# Altium schematic sheet STM32L4.SchDoc
size A4
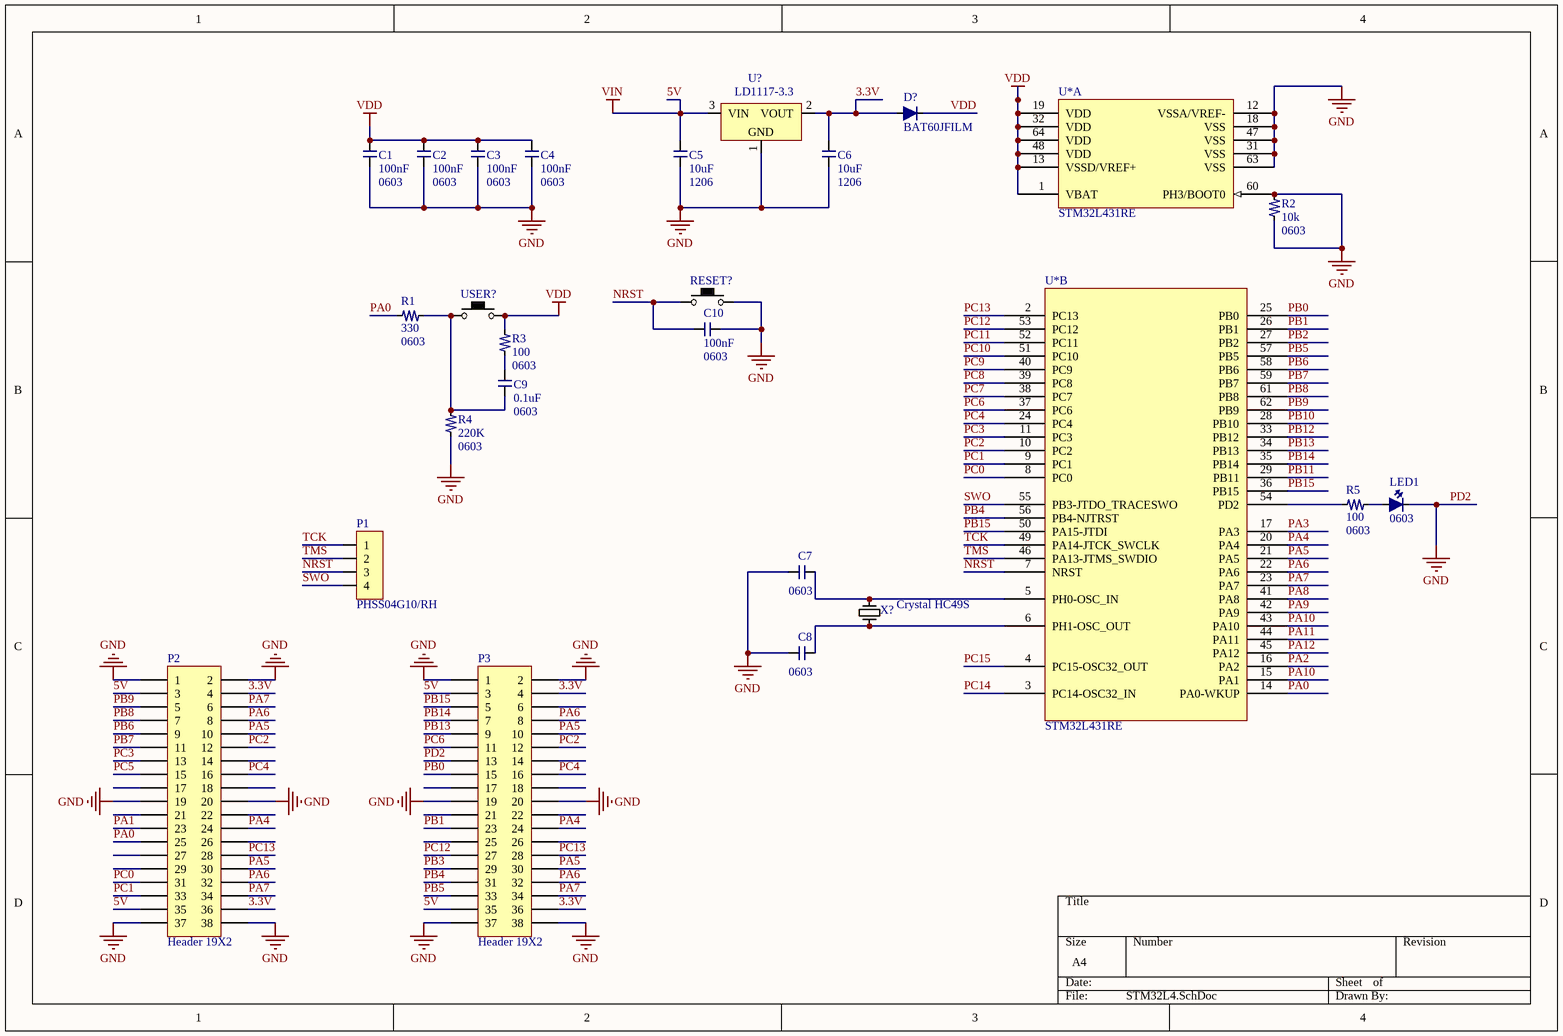
[diagram p0: STM32L4.SchDoc]

## Parts
C1  100nF  [Chip 0603C]
C2  100nF  [Chip 0603C]
C3  100nF  [Chip 0603C]
C4  100nF  [Chip 0603C]
C5  10uF  [Chip 1206C]
C6  10uF  [Chip 1206C]
C7  C HighQ  [Chip 0603C]  (value not drawn)
C8  C HighQ  [Chip 0603C]  (value not drawn)
C9  0.1uF  [Chip 0603C]
C10  100nF  [Chip 0603C]
D?  BAT60JFILM  [SOD323]
LED1  LED  [CHIP LED 0603]  (value not drawn)
P1  PHSS04G10/RH  [PHSS04G10/RH]
P2  Header 19X2  [HDR2X19]
P3  Header 19X2  [HDR2X19]
R1  330  [Chip 0603R]
R2  10k  [Chip 0603R]
R3  100  [Chip 0603R]
R4  220K  [Chip 0603R]
R5  100  [Chip 0603R]
RESET?  Tact Switches  [TC-0102-Series]  (value not drawn)
U*  STM32L431RE  [STM32L431RE-FP]  (parts A,B of 2)
U?  LD1117-3.3  [SOT-223]
USER?  Tact Switches  [TC-0102-Series]  (value not drawn)
X?  Crystal HC49S  [HC-49S]

## Nets
5V: C5.2 P2.3 P2.35 P3.3 P3.35 U?.3(VIN)  [also labelled VIN]
PD2: C1.1 C2.1 C3.1 C4.1 C5.1 C6.1 C7.1 C8.1 C10.2 LED1.2 P2.1 P2.2 P2.19 P2.20 P2.37 P2.38 P3.1 P3.2 P3.13 P3.19 P3.20 P3.37 P3.38 R2.1 R2.2 R4.2 RESET?.2 U*.12(VSSA/VREF-) U*.18(VSS) U*.31(VSS) U*.47(VSS) U*.60(PH3/BOOT0) U*.63(VSS) U?.1(GND)  [also labelled GND]
VDD: C1.2 C2.2 C3.2 C4.2 D?.2 R3.2 U*.1(VBAT) U*.13(VSSD/VREF+) U*.19(VDD) U*.32(VDD) U*.48(VDD) U*.64(VDD) USER?.2
3.3V: C6.2 D?.1 P2.4 P2.36 P3.4 P3.36 U?.2(VOUT)
NRST: C10.1 P1.3 RESET?.1 U*.7(NRST)
PA0: P2.25 R1.2 U*.14(PA0-WKUP)
PA1: P2.23
PA2: U*.16(PA2)
PA3: U*.17(PA3)
PA4: P2.24 P3.24 U*.20(PA4)
PA5: P2.10 P2.30 P3.10 P3.30 U*.21(PA5)
PA6: P2.8 P2.32 P3.8 P3.32 U*.22(PA6)
PA7: P2.6 P2.34 P3.34 U*.23(PA7)
PA8: U*.41(PA8)
PA9: U*.42(PA9)
PA10: U*.15(PA1) U*.43(PA10)
PA11: U*.44(PA11)
PA12: U*.45(PA12)
PB0: P3.15 U*.25(PB0)
PB1: P3.23 U*.26(PB1)
PB2: U*.27(PB2)
PB3: P3.29
PB4: P3.31 U*.56(PB4-NJTRST)
PB5: P3.33 U*.57(PB5)
PB6: P2.9 U*.58(PB6)
PB7: P2.11 U*.59(PB7)
PB8: P2.7 U*.61(PB8)
PB9: P2.5 U*.62(PB9)
PB10: U*.28(PB10)
PB11: U*.29(PB11)
PB12: U*.33(PB12)
PB13: P3.9 U*.34(PB13)
PB14: P3.7 U*.35(PB14)
PB15: P3.5 U*.36(PB15) U*.50(PA15-JTDI)
PC0: P2.31 U*.8(PC0)
PC1: P2.33 U*.9(PC1)
PC2: P2.12 P3.12 U*.10(PC2)
PC3: P2.13 U*.11(PC3)
PC4: P2.16 P3.16 U*.24(PC4)
PC5: P2.15
PC6: P3.11 U*.37(PC6)
PC7: U*.38(PC7)
PC8: U*.39(PC8)
PC9: U*.40(PC9)
PC10: U*.51(PC10)
PC11: U*.52(PC11)
PC12: P3.27 U*.53(PC12)
PC13: P2.28 P3.28 U*.2(PC13)
PC14: U*.3(PC14-OSC32_IN)
PC15: U*.4(PC15-OSC32_OUT)
SWO: P1.4 U*.55(PB3-JTDO_TRACESWO)
TCK: P1.1 U*.49(PA14-JTCK_SWCLK)
TMS: P1.2 U*.46(PA13-JTMS_SWDIO)
NetC7_2: C7.2 U*.5(PH0-OSC_IN) X?.2
NetC8_2: C8.2 U*.6(PH1-OSC_OUT) X?.1
NetC9_1: C9.1 R1.1 R4.1 USER?.1
NetC9_2: C9.2 R3.1
NetLED1_1: LED1.1 R5.2
NetR5_1: R5.1 U*.54(PD2)

Not connected (* = marked no-connect by the designer): P2 14 17 18 21 22 26 27 29; P3 6 14 17 18 21 22 25 26

## Notes on the sheet
- (in symbol 0603-C) 0603
- (in symbol 0603-R) 0603
- (in symbol C0603) 0603
- (in symbol C1206) 1206
- (in symbol LED-0603) 0603

## Library data of the parts
C1-C4 = C0603
C5 C6 = C1206
C7-C10 = 0603-C
LED1 = LED-0603
P2 P3 = Header 19X2: Header, 19-Pin, Dual row; LatestRevisionDate: 17-Jul-2002; LatestRevisionNote: Re-released for DXP Platform.; Publisher: Altium Limited
R1-R5 = 0603-R
RESET? USER? = TC-0102-Series: Tact Switches 6x6mm, Through Hole
U* = STM32L431RB
U? = LD1117AS33TR: Positive Fixed Voltage Regulator LDO 3.3V/1A